# EAGLE design me433_4_2 (EAGLE 8.1.0)
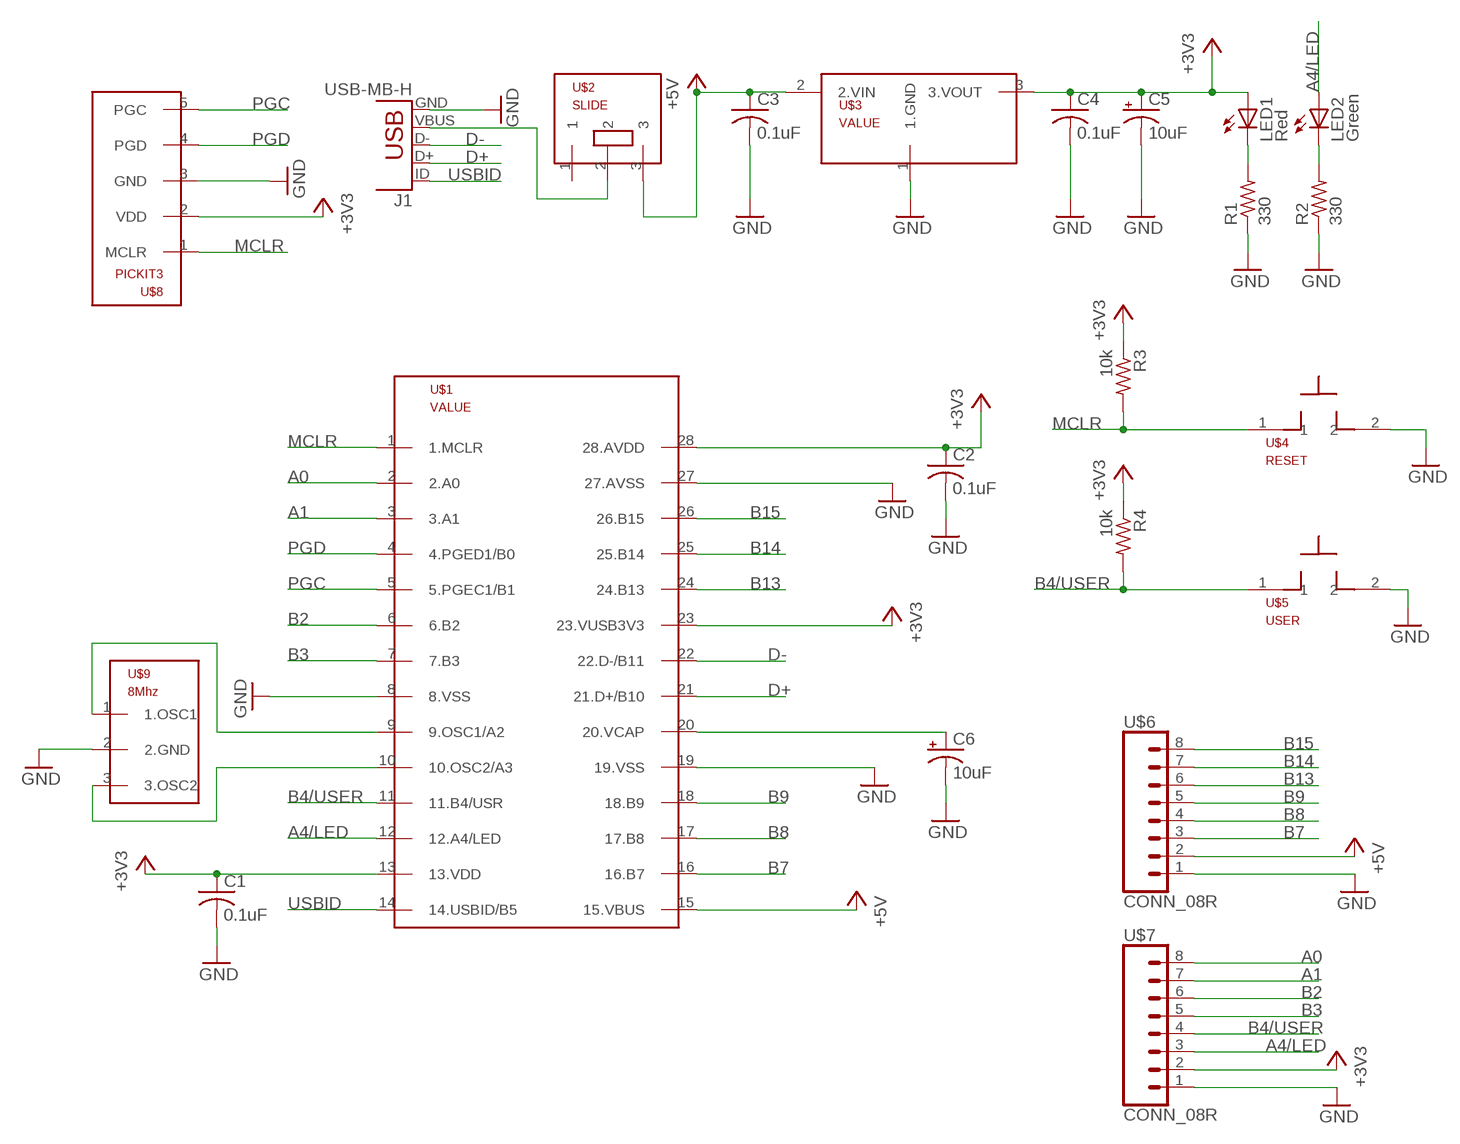
[diagram p0: schematic, sheet 1]

## Parts
C1  0.1uF  C-US025-025X050  [C025-025X050]
C2  0.1uF  C-US025-025X050  [C025-025X050]
C3  0.1uF  C-US025-025X050  [C025-025X050]
C4  0.1uF  C-US025-025X050  [C025-025X050]
C5  10uF  CPOL-USB45181B  [B45181B]
C6  10uF  CPOL-USB45181B  [B45181B]
J1  USB-MB-H  [USB-MB-H]
LED1  Red  LED3MM  [LED3MM]
LED2  Green  LED3MM  [LED3MM]
R1  330  R-US_0207/10  [0207/10]
R2  330  R-US_0207/10  [0207/10]
R3  10k  R-US_0207/10  [0207/10]
R4  10k  R-US_0207/10  [0207/10]
U$1  PIC32MX250F128B  [DIL28-3]
U$2  SLIDE  [SLIDE]
U$3  MCP1702  [TO92]
U$4  RESET  PB  [PB]
U$5  USER  PB  [PB]
U$6  CONN_08R  [1X08]
U$7  CONN_08R  [1X08]
U$8  PICKIT3  [1X05]
U$9  8Mhz  OSCOSC  [OSC]

## Nets
+3V3: C1.1 C2.1 C4.1 C5.+ LED1.A R3.1 R4.1 U$1.13(13.VDD) U$1.23(23.VUSB3V3) U$1.28(28.AVDD) U$3.3(3.VOUT) U$7.2 U$8.2(VDD)
+5V: C3.1 U$1.15(15.VBUS) U$2.3 U$3.2(2.VIN) U$6.2
A0: U$1.2(2.A0) U$7.8
A1: U$1.3(3.A1) U$7.7
A4/LED: LED2.A U$1.12(12.A4/LED) U$7.3
B2: U$1.6(6.B2) U$7.6
B3: U$1.7(7.B3) U$7.5
B4/USER: R4.2 U$1.11(11.B4/USR) U$5.1 U$7.4
B7: U$1.16(16.B7) U$6.3
B8: U$1.17(17.B8) U$6.4
B9: U$1.18(18.B9) U$6.5
B13: U$6.6
B14: U$1.25(25.B14) U$6.7
B15: U$1.26(26.B15) U$6.8
D+: J1.D+ U$1.21(21.D+/B10)
D-: J1.D- U$1.22(22.D-/B11)
GND: C1.2 C2.2 C3.2 C4.2 C5.- C6.- J1.GND R1.1 R2.1 U$1.8(8.VSS) U$1.19(19.VSS) U$1.27(27.AVSS) U$3.1(1.GND) U$4.2 U$5.2 U$6.1 U$7.1 U$8.3(GND) U$9.2(2.GND)
MCLR: R3.2 U$1.1(1.MCLR) U$4.1 U$8.1(MCLR)
N$1: J1.VBUS U$2.2
N$2: U$1.9(9.OSC1/A2) U$9.1(1.OSC1)
N$3: LED1.K(C) R1.2
N$4: LED2.K(C) R2.2
N$6: U$1.10(10.OSC2/A3) U$9.3(3.OSC2)
N$8: C6.+ U$1.20(20.VCAP)
PGC: U$1.5(5.PGEC1/B1) U$8.5(PGC)
PGD: U$1.4(4.PGED1/B0) U$8.4(PGD)
USBID: J1.ID U$1.14(14.USBID/B5)
Unconnected: U$1.24(24.B13) U$2.1

## Library data of the parts
C1-C4 = resistor:C-US: CAPACITOR, American symbol
C5 C6 = resistor:CPOL-US: POLARIZED CAPACITOR, American symbol
J1 = me433:USB: USB Connectors USB-B-PTH is fully proven SKU : PRT-00139/CONN-08278 USB-miniB is fully proven SKU : PRT-00587 USB-A-PCB is untested. USB-A-H is throughly reviewed, but untested. Spark Fun Electronics SKU : PRT-00437 USB-B-SMT is throughly reviewed, but untested. Needs silkscreen touching up. USB-A-S has not been used/tested USB-MB-H has not been used/tested USB-MICROB has been used. CONN-09505
LED1 LED2 = led:LED: LED OSRAM: - CHIPLED LG R971, LG N971, LY N971, LG Q971, LY Q971, LO R971, LY R971 LH N974, LH R974 LS Q976, LO Q976, LY Q976 LO Q996 - Hyper CHIPLED LW Q18S LB Q993, LB Q99A, LB R99A - SideLED LS A670, LO A670, LY A670, LG A670, LP A670 LB A673, LV A673, LT A673, LW A673 LH A674 LY A675 LS A676, LA A676, LO A676, LY A676, LW A676 LS A679, LY A679, LG A679 - Hyper Micro SIDELED® LS Y876, LA Y876, LO Y876, LY Y876 LT Y87S - SmartLED LW L88C, LW L88S LB L89C, LB L89S, LG L890 LS L89K, LO L89K, LY L89K LS L896, LA L896, LO L896, LY L896 - TOPLED LS T670, LO T670, LY T670, LG T670, LP T670 LSG T670, LSP T670, LSY T670, LOP T670, LYG T670 LG T671, LOG T671, LSG T671 LB T673, LV T673, LT T673, LW T673 LH T674 LS T676, LA T676, LO T676, LY T676, LB T676, LH T676, LSB T676, LW T676 LB T67C, LV T67C, LT T67C, LS T67K, LO T67K, LY T67K, LW E67C LS E67B, LA E67B, LO E67B, LY E67B, LB E67C, LV E67C, LT E67C LW T67C LS T679, LY T679, LG T679 LS T770, LO T770, LY T770, LG T770, LP T770 LB T773, LV T773, LT T773, LW T773 LH T774 LS E675, LA E675, LY E675, LS T675 LS T776, LA T776, LO T776, LY T776, LB T776 LHGB T686 LT T68C, LB T68C - Hyper Mini TOPLED® LB M676 - Mini TOPLED Santana® LG M470 LS M47K, LO M47K, LY M47K Source: http://www.osram.convergy.de LUXEON: - LUMILED® LXK2-PW12-R00, LXK2-PW12-S00, LXK2-PW14-U00, LXK2-PW14-V00 LXK2-PM12-R00, LXK2-PM12-S00, LXK2-PM14-U00 LXK2-PE12-Q00, LXK2-PE12-R00, LXK2-PE12-S00, LXK2-PE14-T00, LXK2-PE14-U00 LXK2-PB12-K00, LXK2-PB12-L00, LXK2-PB12-M00, LXK2-PB14-N00, LXK2-PB14-P00, LXK2-PB14-Q00 LXK2-PR12-L00, LXK2-PR12-M00, LXK2-PR14-Q00, LXK2-PR14-R00 LXK2-PD12-Q00, LXK2-PD12-R00, LXK2-PD12-S00 LXK2-PH12-R00, LXK2-PH12-S00 LXK2-PL12-P00, LXK2-PL12-Q00, LXK2-PL12-R00 Source: www.luxeon.com KINGBRIGHT: KA-3528ASYC Source: www.kingbright.com
R1-R4 = resistor:R-US_: RESISTOR, American symbol
U$1 = me433:PIC32MX250F128B
U$2 = me433:SLIDE
U$3 = me433:MCP1702
U$4 U$5 = me433:PB
U$6 U$7 = me433:CONN_08R
U$8 = me433:PICKIT3
U$9 = me433:OSC

## Board
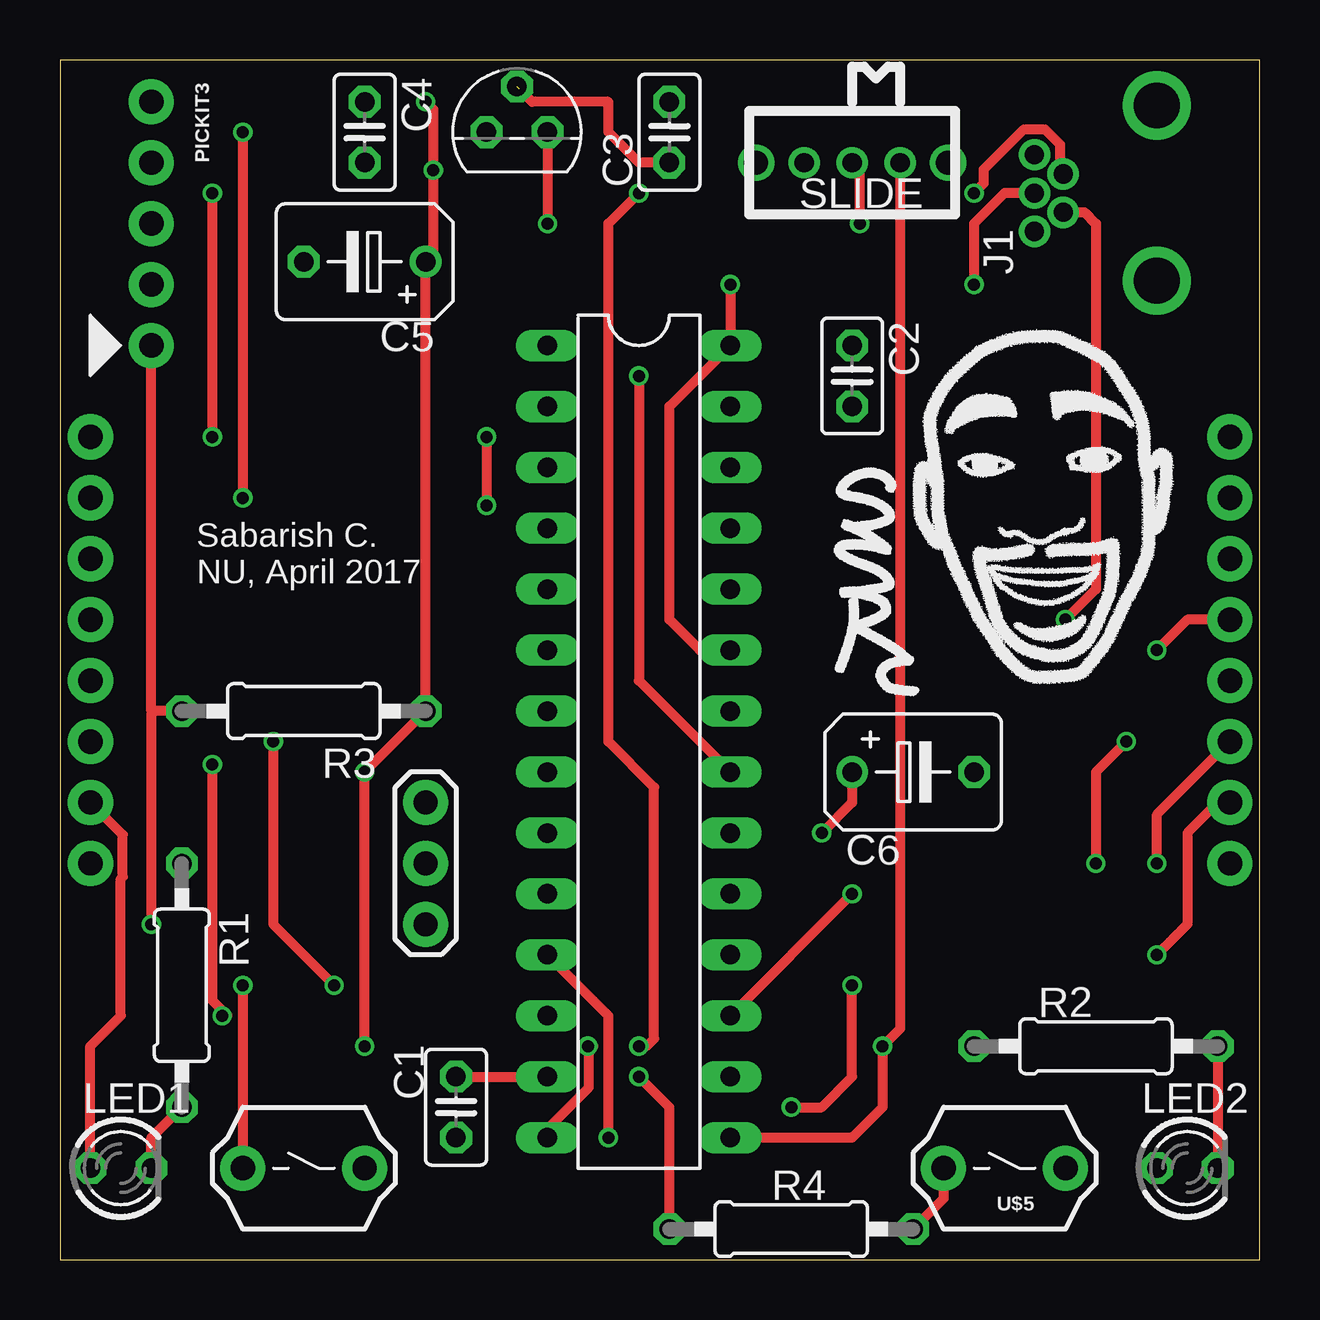
[diagram p1: board, top side]
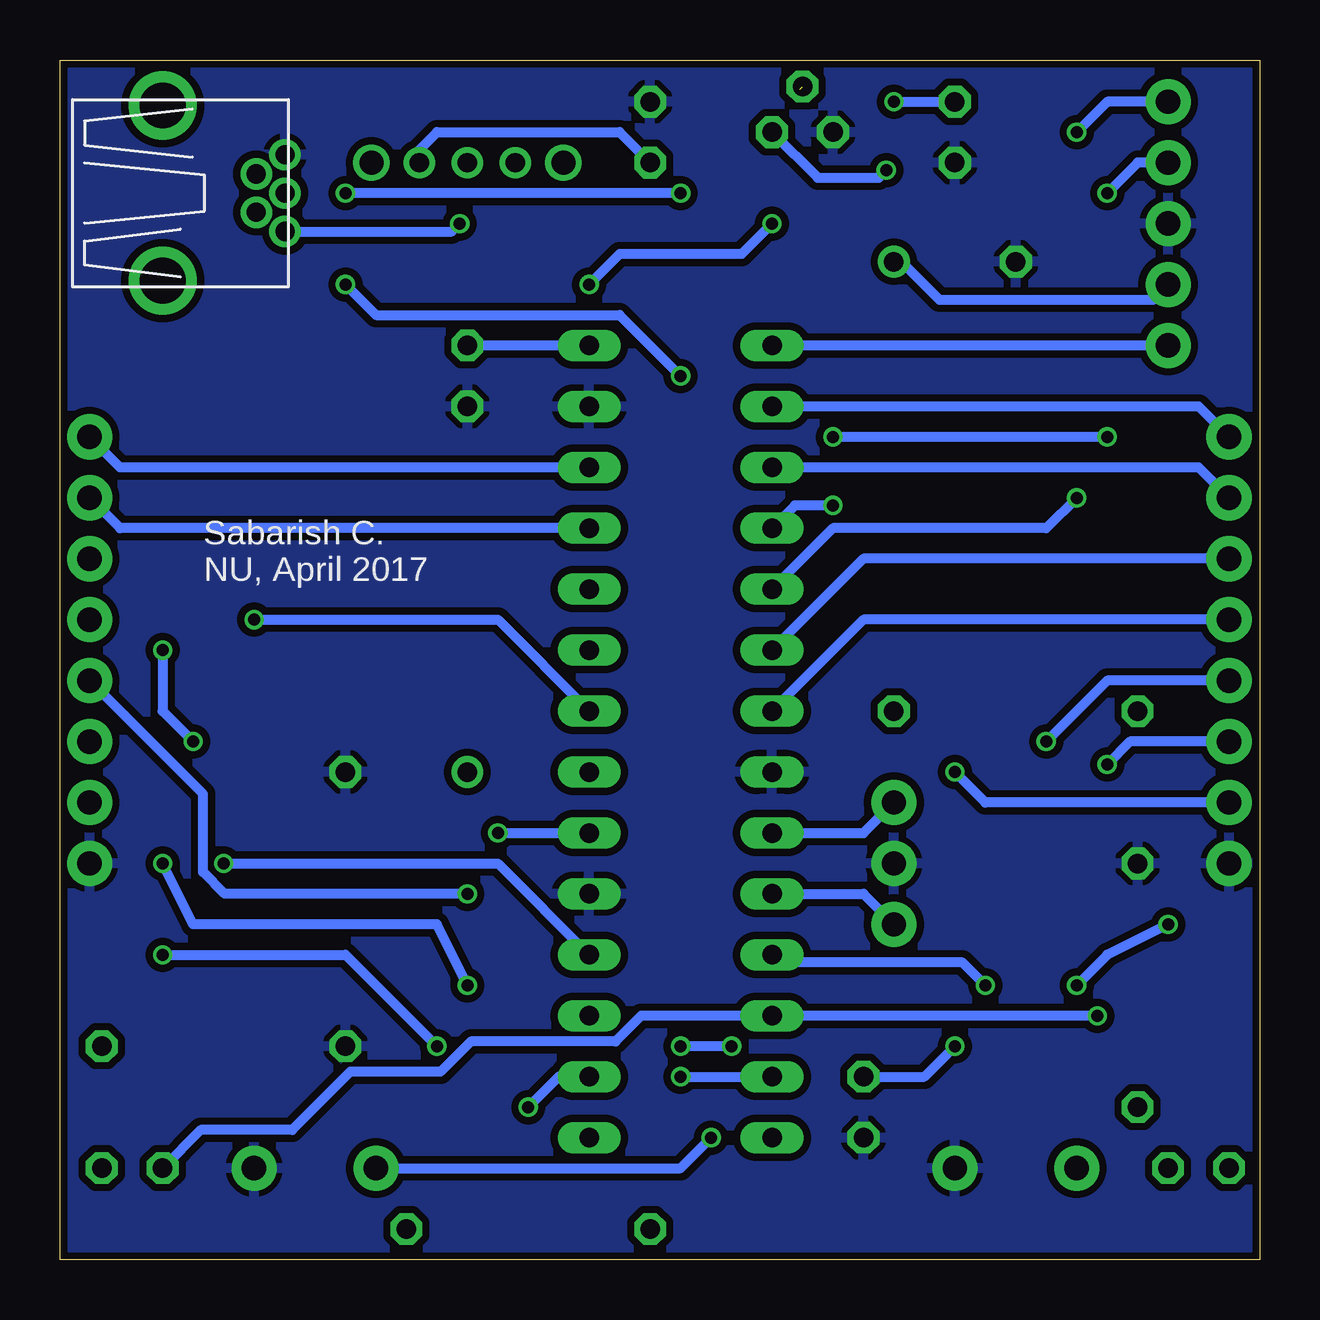
[diagram p2: board, bottom side, seen from below]

Size 50 x 50 mm. Coordinates in mm from the lower left corner, seen from the top.
Outline: 0,0 50,0 50,50 0,50 0,0
Copper layers (1*16): Top 0.035mm / dielectric 1.5mm / Bottom 0.035mm
Design rules "SeeedStudio_2layer_DRU_no_angle_20140221": minimum track width 6mil, minimum drill 12mil, track to track 6mil, track to pad 6mil, pad to pad 6mil, via to via 6mil, smd to smd 0mil, copper to edge 10mil, drill to drill 10mil, minimum pad ring 10mil, minimum via ring 6mil, stop-mask expansion 2mil, vias tented up to drill 100mil, thermal gap 10mil

### Footprints (pad centres in the part's own frame; a part is rotated, then mirrored left to right if it is on the bottom)
C025-025X050 = drill 0.813 octagon: 1 -1.27,0; 2 1.27,0
B45181B = drill 0.813: + -2.54,0 | drill 0.813 octagon: - 2.54,0
USB-MB-H = drill 0.8: D+ 5.1,0; D- 3.9,0.8; GND 5.1,-1.6; ID 3.9,-0.8; VBUS 5.1,1.6 | drill 1.9: P$6 0,-3.65; P$7 0,3.65
LED3MM = drill 0.813 octagon: A -1.27,0; K 1.27,0
0207/10 = drill 0.813 octagon: 1 -5.08,0; 2 5.08,0
DIL28-3 = drill 0.813 long: 1 -16.51,-3.81; 2 -13.97,-3.81; 3 -11.43,-3.81; 4 -8.89,-3.81; 5 -6.35,-3.81; 6 -3.81,-3.81; 7 -1.27,-3.81; 8 1.27,-3.81; 9 3.81,-3.81; 10 6.35,-3.81; 11 8.89,-3.81; 12 11.43,-3.81; 13 13.97,-3.81; 14 16.51,-3.81; 15 16.51,3.81; 16 13.97,3.81; 17 11.43,3.81; 18 8.89,3.81; 19 6.35,3.81; 20 3.81,3.81; 21 1.27,3.81; 22 -1.27,3.81; 23 -3.81,3.81; 24 -6.35,3.81; 25 -8.89,3.81; 26 -11.43,3.81; 27 -13.97,3.81; 28 -16.51,3.81
SLIDE = drill 0.8: 1 -2,0; 2 0,0; 3 2,0 | drill 1: P$1 -4,0; P$2 4,0
TO92 = drill 0.813 octagon: 1 -1.27,0; 2 0,1.905; 3 1.27,0
PB = drill 1.016 pad 1.88: 1 -2.54,0; 2 2.54,0
1X08 = drill 1.016 pad 1.88: 1 0,0; 2 2.54,0; 3 5.08,0; 4 7.62,0; 5 10.16,0; 6 12.7,0; 7 15.24,0; 8 17.78,0
1X05 = drill 1.016 pad 1.88: 1 0,0; 2 2.54,0; 3 5.08,0; 4 7.62,0; 5 10.16,0
OSC = drill 1.016 pad 1.88: 1 -2.54,0; 2 0,0; 3 2.54,0

### Placement (x,y rotation side)
C1  16.51,6.35 270 top
C2  33.02,36.83 270 top
C3  25.4,46.99 90 top
C4  12.7,46.99 270 top
C5  12.7,41.59 180 top
C6  35.56,20.32 0 top
J1  45.72,44.45 180 top
LED1  2.54,3.81 0 top
LED2  46.99,3.81 0 top
R1  5.08,11.43 270 top
R2  43.18,8.89 0 top
R3  10.16,22.86 180 top
R4  30.48,1.27 0 top
U$1  24.13,21.59 270 top
U$2  33.02,45.72 0 top
U$3  19.05,46.99 0 top
U$4  10.16,3.81 0 top
U$5  39.37,3.81 0 top
U$6  48.77,16.51 90 top
U$7  1.27,16.51 90 top
U$8  3.81,38.1 90 top
U$9  15.24,16.51 270 top

### Tracks (layer width: path | path; a pad name or v marks a point on that pad's centre or on a via)
+3V3  (via drill 0.5)
  Top 0.406: v15.24,48.26 15.56,47.94 v15.56,45.4 15.56,41.91 C5.+ R3.1 v12.7,20.32 v12.7,8.89 | LED1.A 1.27,8.89 2.54,10.16 2.54,15.88 2.62,15.95 2.62,17.7 U$7.2 | C1.1 U$1.13 | R4.1 25.4,6.35 v24.13,7.62 | U$1.23 26.67,25.4 25.4,26.67 25.4,35.56 U$1.28 v27.94,40.64 | U$3.3 v20.32,43.18
  Bottom 0.406: U$3.3 18.41,45.09 15.88,45.09 v15.56,45.4 | v15.24,48.26 C4.1 | C5.+ 14.92,41.59 13.34,40.01 4.45,40.01 U$8.2 | U$7.2 11.43,19.05 v12.7,20.32 | v24.13,7.62 U$1.13 | C1.1 13.97,7.62 v12.7,8.89 | U$1.28 C2.1 | v20.32,43.18 21.59,41.91 26.67,41.91 v27.94,40.64
+5V  (via drill 0.5)  (1 unrouted)
  Top 0.406: C3.1 24.13,45.72 22.86,46.99 22.86,48.26 19.68,48.26 19.16,48.78 | U$6.2 48.26,19.05 46.99,17.78 46.99,13.97 v45.72,12.7 | U$1.15 33.02,5.08 34.29,6.35 v34.29,8.89 35.02,9.62 U$2.3
  Bottom 0.406: U$2.3 35.02,46.26 34.29,46.99 26.67,46.99 C3.1 | v45.72,12.7 38.1,12.7 v34.29,8.89
A0
  Bottom 0.406: U$7.8 2.54,35.56 U$1.2
A1
  Bottom 0.406: U$7.7 2.54,33.02 U$1.3
A4/LED  (via drill 0.5)
  Top 0.406: v6.35,20.64 6.35,10.79 6.99,10.16 v6.76,10.16
  Bottom 0.406: U$7.3 5.4,21.59 v6.35,20.64 | v6.76,10.16 U$1.12 25.77,10.16 26.84,9.09 32.87,9.09 34.14,7.82 37.9,7.82 40.32,5.4 44.13,5.4 LED2.A
B2
  Bottom 0.406: U$7.6 16.51,29.21 U$1.6
B3
  Bottom 0.406: U$7.5 16.51,26.67 U$1.7
B4/USER  (via drill 0.5)
  Top 0.406: v8.89,21.59 8.89,13.97 v11.43,11.43 | v22.86,5.08 22.86,10.16 U$1.11 | U$5.1 36.83,2.54 R4.2
  Bottom 0.406: U$7.4 6.35,24.13 v8.89,21.59 | v11.43,11.43 12.38,12.38 20,12.38 U$1.11 | U$5.1 24.13,3.81 v22.86,5.08
B7  (via drill 0.5)
  Top 0.406: v30.48,6.35 31.75,6.35 33.02,7.62 v33.02,11.43 | v45.72,16.51 45.72,18.54 U$6.3
  Bottom 0.406: U$1.16 29.21,7.62 v30.48,6.35 | v33.02,11.43 34.29,13.97 44.45,13.97 v45.72,16.51
B8  (via drill 0.5)
  Top 0.406: U$1.17 v33.02,15.24
  Bottom 0.406: U$6.4 44.04,19.4 44.04,16.15 43.13,15.24 v33.02,15.24
B9  (via drill 0.5)
  Top 0.406: U$6.5 46.99,26.67 v45.72,25.4 | v44.45,21.59 43.18,20.32 v43.18,16.51
  Bottom 0.406: v45.72,25.4 45.72,22.86 v44.45,21.59 | v43.18,16.51 31.75,16.51 U$1.18
B14
  Bottom 0.406: U$1.25 47.5,30.48 U$6.7
B15
  Bottom 0.406: U$1.26 47.5,33.02 U$6.8
D+  (via drill 0.5)
  Top 0.406: J1.D+ 39.37,44.45 38.1,43.18 v38.1,40.64 | v24.13,36.83 24.13,24.13 U$1.21
  Bottom 0.406: v38.1,40.64 36.83,39.37 26.67,39.37 v24.13,36.83
D-  (via drill 0.5)
  Top 0.406: J1.D- 42.71,43.65 43.18,43.18 43.18,27.94 v41.91,26.67
  Bottom 0.406: v41.91,26.67 31.75,26.67 U$1.22
GND
  pour Bottom (isolate 0.305): 0,0 49.53,0 49.53,49.53 0,49.53
MCLR  (via drill 0.5)
  Top 0.406: 3.81,22.86 U$8.1 | 3.81,22.86 v3.81,13.97 | v7.62,11.43 U$4.1 | R3.2 3.81,22.86
  Bottom 0.406: U$8.1 U$1.1 | v3.81,13.97 6.35,12.7 v7.62,11.43
N$1  (via drill 0.5)
  Top 0.406: v33.34,43.18 33.34,45.4 U$2.2
  Bottom 0.406: J1.VBUS 33.67,42.85 v33.34,43.18
N$2
  Bottom 0.406: U$1.9 16.51,17.78 U$9.1
N$3
  Top 0.406: LED1.K 3.81,5.08 R1.2
N$4
  Top 0.406: R2.2 LED2.K
N$6
  Bottom 0.406: U$1.10 16.51,15.24 U$9.3
N$8  (via drill 0.5)
  Top 0.406: C6.+ 33.02,19.05 v31.75,17.78
  Bottom 0.406: v31.75,17.78 U$1.20
PGC  (via drill 0.5)
  Top 0.406: v7.62,46.99 v7.62,31.75
  Bottom 0.406: U$8.5 6.35,48.26 v7.62,46.99 | v7.62,31.75 8.89,30.48 17.78,30.48 U$1.5
PGD  (via drill 0.5)
  Top 0.406: v6.35,44.45 v6.35,34.29 | v17.78,34.29 v17.78,31.43
  Bottom 0.406: U$8.4 5.08,45.72 v6.35,44.45 | v6.35,34.29 v17.78,34.29 | v17.78,31.43 19.37,31.43 U$1.4
USBID  (via drill 0.5)
  Top 0.406: U$1.14 20.32,5.45 22.05,7.18 22.05,8.71 22.23,8.89 v22,8.89 | v24.13,8.89 24.45,8.89 24.77,9.21 24.77,19.68 22.86,21.59 22.86,43.18 v24.13,44.45 | v38.1,44.45 38.51,44.86 38.51,45.44 40.18,47.11 41.06,47.11 41.68,46.49 41.68,45.39 J1.ID
  Bottom 0.406: v22,8.89 v24.13,8.89 | v24.13,44.45 v38.1,44.45

### Text on the board
tPlace: Sabarish C. / NU, April 2017
bPlace: Sabarish C. / NU, April 2017